# EAGLE design AC-DC 5V Power Supply (EAGLE 9.6.2)
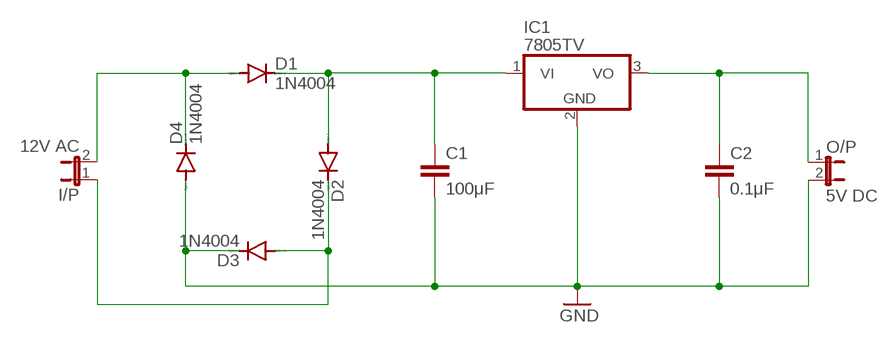
[diagram p0: schematic, sheet 1]

## Parts
C1  100μF  C2.5/2  [C2.5-2]
C2  0.1μF  C2.5/2  [C2.5-2]
D1  1N4004  [DO41-10]
D2  1N4004  [DO41-10]
D3  1N4004  [DO41-10]
D4  1N4004  [DO41-10]
I/P  12V AC  JP1E  [JP1]
IC1  7805TV  [TO220V]
O/P  5V DC  JP1E  [JP1]

## Nets
GND: C1.2 C2.2 D3.C D4.A IC1.2(GND) O/P.2
N$1: D1.A D4.C I/P.2
N$2: C1.1 D1.C D2.A IC1.1(VI)
N$3: D2.C D3.A I/P.1
N$5: C2.1 IC1.3(VO) O/P.1

## Library data of the parts
C1 C2 = capacitor-wima:C: CAPACITOR naming: grid - package width
D1-D4 = diode:1N4004: DIODE general purpose rectifier, 1 A
I/P O/P = jumper:JP1E: JUMPER
IC1 = linear:78*: Positive VOLTAGE REGULATOR Source: http://cache.national.com/ds/LM/LM78L05.pdf http://www.fairchildsemi.com/ds/LM/LM7805.pdf

## Board
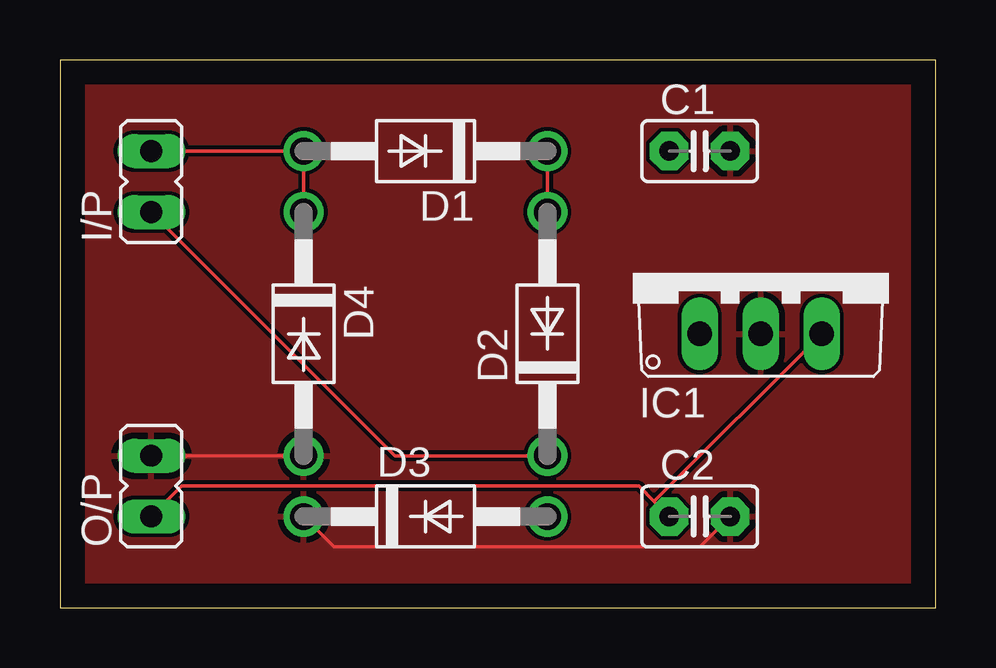
[diagram p1: board, top side]
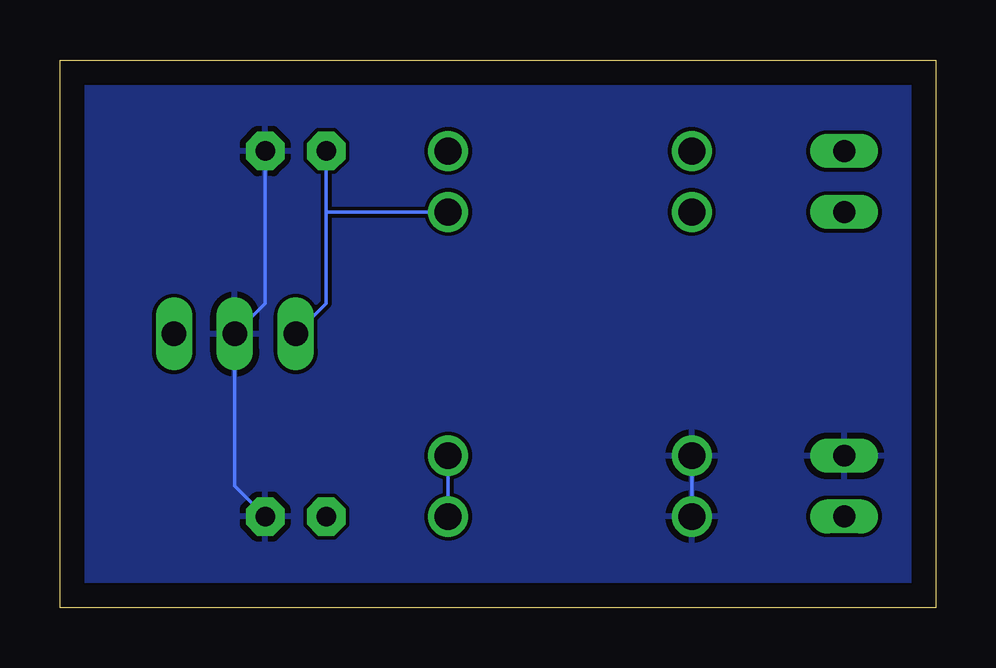
[diagram p2: board, bottom side, seen from below]

Size 36.5 x 22.85 mm. Coordinates in mm from the lower left corner, seen from the top.
Outline: 0,0 36.5,0 36.5,22.85 0,22.85 0,0
Copper layers (1*16): Top 0.035mm / dielectric 1.5mm / Bottom 0.035mm
Design rules "default": minimum track width 6mil, minimum drill 0.35mm, track to track 6mil, track to pad 6mil, pad to pad 6mil, via to via 6mil, smd to smd 6mil, copper to edge 40mil, drill to drill 6mil, minimum pad ring 10mil, minimum via ring 8mil, stop-mask expansion 4mil, vias tented up to drill 0mil, thermal gap 10mil

### Footprints (pad centres in the part's own frame; a part is rotated, then mirrored left to right if it is on the bottom)
C2.5-2 = drill 0.813 pad 1.6 octagon: 1 -1.27,0; 2 1.27,0
DO41-10 = drill 1.118: A 5.08,0; C -5.08,0
JP1 = drill 0.914 long: 1 0,-1.27; 2 0,1.27
TO220V = drill 1.016 long: 1 -2.54,-2.54; 2 0,-2.54; 3 2.54,-2.54

### Placement (x,y rotation side)
C1  26.67,19.05 0 top
C2  26.67,3.81 0 top
D1  15.24,19.05 180 top
D2  20.32,11.43 90 top
D3  15.24,3.81 0 top
D4  10.16,11.43 270 top
I/P  3.81,17.78 0 top
IC1  29.21,13.97 0 top
O/P  3.81,5.08 0 top

### Tracks (layer width: path | path; a pad name or v marks a point on that pad's centre or on a via)
GND
  Top 0.152: D4.A O/P.2 | D3.C 11.43,2.54 26.67,2.54 C2.2
  Bottom 0.152: D4.A D3.C | C1.2 27.94,12.7 IC1.2 29.21,5.08 C2.2
  pour Top: -1.27,24.13 -1.27,-1.27 38.1,-1.27 38.1,24.13
  pour Bottom: -2.54,25.4 39.37,25.4 39.37,-2.54 -2.54,-2.54
N$1
  Top 0.152: I/P.2 D1.A D4.C
N$2
  Top 0.152: D1.C D2.A
  Bottom 0.152: IC1.1 25.4,12.7 25.4,16.51 | C1.1 25.4,16.51 | 25.4,16.51 D2.A
N$3
  Top 0.152: I/P.1 13.97,6.35 D2.C
  Bottom 0.152: D2.C D3.A
N$5
  Top 0.152: O/P.1 5.08,5.08 24.13,5.08 24.77,4.45 | C2.1 24.77,4.45 | 24.77,4.45 IC1.3

### Text on the board
tValues: 64 | VM